# EAGLE design HSIO (EAGLE 6.4)
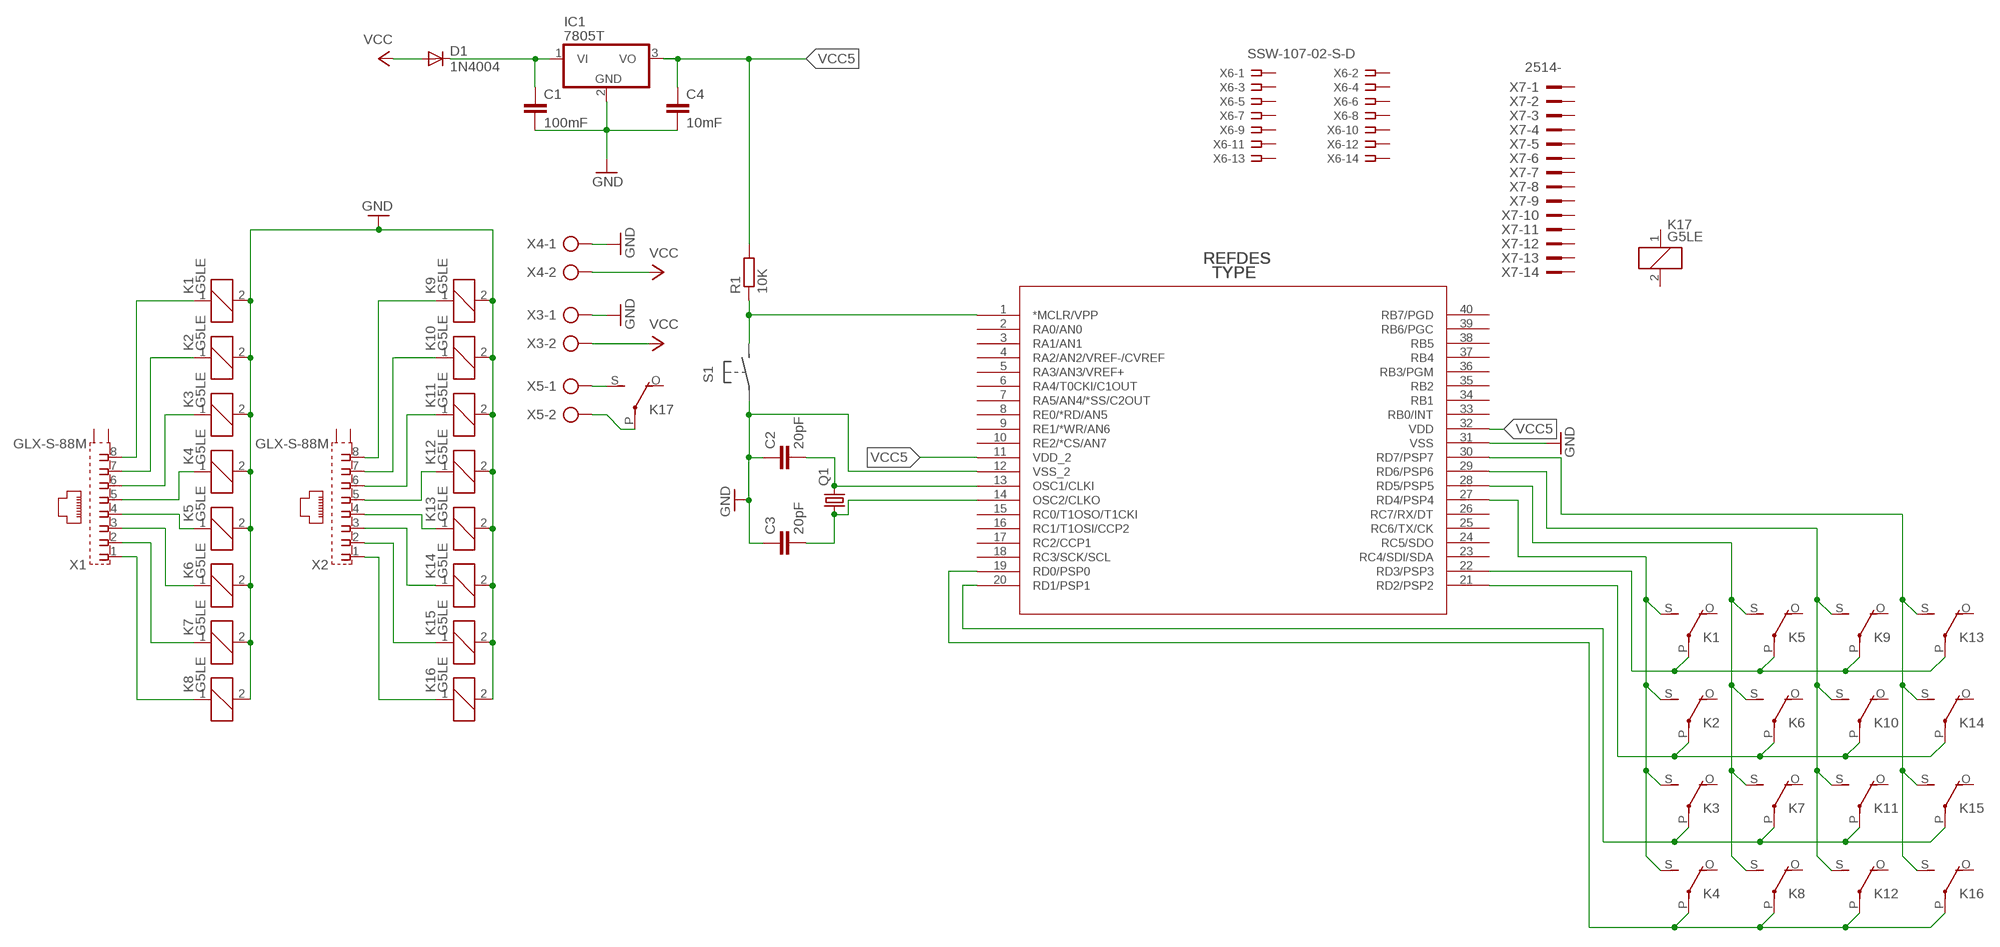
[diagram p0: schematic, sheet 1]

## Parts
C1  100mF  C10/4  [C10B4]
C2  20pF  C10/4  [C10B4]
C3  20pF  C10/4  [C10B4]
C4  10mF  C10/4  [C10B4]
D1  1N4004  [DO41-10]
IC1  7805T  [TO220H]
K1  G5LE  [G5LE]
K2  G5LE  [G5LE]
K3  G5LE  [G5LE]
K4  G5LE  [G5LE]
K5  G5LE  [G5LE]
K6  G5LE  [G5LE]
K7  G5LE  [G5LE]
K8  G5LE  [G5LE]
K9  G5LE  [G5LE]
K10  G5LE  [G5LE]
K11  G5LE  [G5LE]
K12  G5LE  [G5LE]
K13  G5LE  [G5LE]
K14  G5LE  [G5LE]
K15  G5LE  [G5LE]
K16  G5LE  [G5LE]
K17  G5LE  [G5LE]
Q1  CRYSTALHC49S  [HC49/S]
R1  10K  R-EU_0207/10  [0207/10]
U$1  PIC16F877A-X/P  [PDIP40_600MC]
X1  GLX-S-88M  [GLX-S-88M]
X2  GLX-S-88M  [GLX-S-88M]
X3  AK300/2  [AK300/2]
X4  AK300/2  [AK300/2]
X5  AK300/2  [AK300/2]
X6  SSW-107-02-S-D  [SSW-107-02-S-D]
X7  2514-  [PAK100/2500-14]

## Nets
GND: C1.2 C2.1 C3.1 C4.2 IC1.2(GND) K1.2 K2.2 K3.2 K4.2 K5.2 K6.2 K7.2 K8.2 K9.2 K10.2 K11.2 K12.2 K13.2 K14.2 K15.2 K16.2 U$1.12(VSS_2) U$1.31(VSS) X3.1 X4.1
N$1: K1.1 X1.8
N$2: K2.1 X1.7
N$3: K3.1 X1.6
N$4: K4.1 X1.5
N$5: K5.1 X1.4
N$6: K9.1 X2.8
N$7: K10.1 X2.7
N$8: K11.1 X2.6
N$9: K6.1 X1.3
N$10: K7.1 X1.2
N$11: K8.1 X1.1
N$12: K12.1 X2.5
N$13: K13.1 X2.4
N$14: K14.1 X2.3
N$15: K17.S(2:S) X5.1
N$16: K17.P(2:P) X5.2
N$17: K15.1 X2.2
N$18: K16.1 X2.1
N$19: K1.S(2:S) K2.S(2:S) K3.S(2:S) K4.S(2:S) U$1.27(RD4/PSP4)
N$20: K5.S(2:S) K6.S(2:S) K7.S(2:S) K8.S(2:S) U$1.28(RD5/PSP5)
N$21: K9.S(2:S) K10.S(2:S) K11.S(2:S) K12.S(2:S) U$1.29(RD6/PSP6)
N$22: K13.S(2:S) K14.S(2:S) K15.S(2:S) K16.S(2:S) U$1.30(RD7/PSP7)
N$23: K1.P(2:P) K5.P(2:P) K9.P(2:P) K13.P(2:P) U$1.22(RD3/PSP3)
N$24: K2.P(2:P) K6.P(2:P) K10.P(2:P) K14.P(2:P) U$1.21(RD2/PSP2)
N$25: K3.P(2:P) K7.P(2:P) K11.P(2:P) K15.P(2:P) U$1.20(RD1/PSP1)
N$26: K4.P(2:P) K8.P(2:P) K12.P(2:P) K16.P(2:P) U$1.19(RD0/PSP0)
N$28: C2.2 Q1.2 U$1.13(OSC1/CLKI)
N$29: R1.1 U$1.1(*MCLR/VPP)
N$30: C1.1 D1.C IC1.1(VI)
N$31: C3.2 Q1.1 U$1.14(OSC2/CLKO)
VCC: D1.A X3.2 X4.2
VCC5: C4.1 IC1.3(VO) R1.2 U$1.11(VDD_2) U$1.32(VDD)
Unconnected: K1.O(2:O) K2.O(2:O) K3.O(2:O) K4.O(2:O) K5.O(2:O) K6.O(2:O) K7.O(2:O) K8.O(2:O) K9.O(2:O) K10.O(2:O) K11.O(2:O) K12.O(2:O) K13.O(2:O) K14.O(2:O) K15.O(2:O) K16.O(2:O) K17.1 K17.2 K17.O(2:O) U$1.2(RA0/AN0) U$1.3(RA1/AN1) U$1.4(RA2/AN2/VREF-/CVREF) U$1.5(RA3/AN3/VREF+) U$1.6(RA4/T0CKI/C1OUT) U$1.7(RA5/AN4/*SS/C2OUT) U$1.8(RE0/*RD/AN5) U$1.9(RE1/*WR/AN6) U$1.10(RE2/*CS/AN7) U$1.15(RC0/T1OSO/T1CKI) U$1.16(RC1/T1OSI/CCP2) U$1.17(RC2/CCP1) U$1.18(RC3/SCK/SCL) U$1.23(RC4/SDI/SDA) U$1.24(RC5/SDO) U$1.25(RC6/TX/CK) U$1.26(RC7/RX/DT) U$1.33(RB0/INT) U$1.34(RB1) U$1.35(RB2) U$1.36(RB3/PGM) U$1.37(RB4) U$1.38(RB5) U$1.39(RB6/PGC) U$1.40(RB7/PGD) X1.S1 X1.S2 X2.S1 X2.S2 X6.1 X6.2 X6.3 X6.4 X6.5 X6.6 X6.7 X6.8 X6.9 X6.10 X6.11 X6.12 X6.13 X6.14 X7.1 X7.2 X7.3 X7.4 X7.5 X7.6 X7.7 X7.8 X7.9 X7.10 X7.11 X7.12 X7.13 X7.14

## Library data of the parts
C1-C4 = capacitor-wima:C: CAPACITOR naming: grid - package width
D1 = diode:1N4004: DIODE general purpose rectifier, 1 A
IC1 = linear:78*: Positive VOLTAGE REGULATOR Source: http://cache.national.com/ds/LM/LM78L05.pdf http://www.fairchildsemi.com/ds/LM/LM7805.pdf
K1-K17 = relay:G5LE: RELAY 1 x switch, 10 A/120 V AC, 8 A/30 V DC, Omron; OC_FARNELL: unknown; OC_NEWARK: unknown
Q1 = crystal:CRYSTAL: CRYSTAL; OC_FARNELL: 1667008; OC_NEWARK: unknown
R1 = resistor:R-EU_: RESISTOR, European symbol
U$1 = PIC16F877A:PIC16F877A-X/P
X1 X2 = con-kycon:GLX-S-88M: Mod. Jack, Right Angle, 8 posiotion, 8 contatcs RJ45 Source: GLX-S-88M.pdf; OC_FARNELL: unknown; OC_NEWARK: unknown
X3-X5 = con-ptr500:AK300/2: CONNECTOR; OC_FARNELL: unknown; OC_NEWARK: unknown
X6 = con-samtec:SSW-107-02-S-D: THROUGH-HOLE .025" SQ POST SOCKET Source: Samtec SSW.pdf; MPN: SSW-107-02-S-D; OC_FARNELL: unknown; OC_NEWARK: 11P9431
X7 = con-3m:2514-: 3M (TM) Pak 100 4-Wall Header Source: 3M; OC_FARNELL: unknown; OC_NEWARK: unknown

## Net classes
0 default: clearance 0.355 mm

## Board
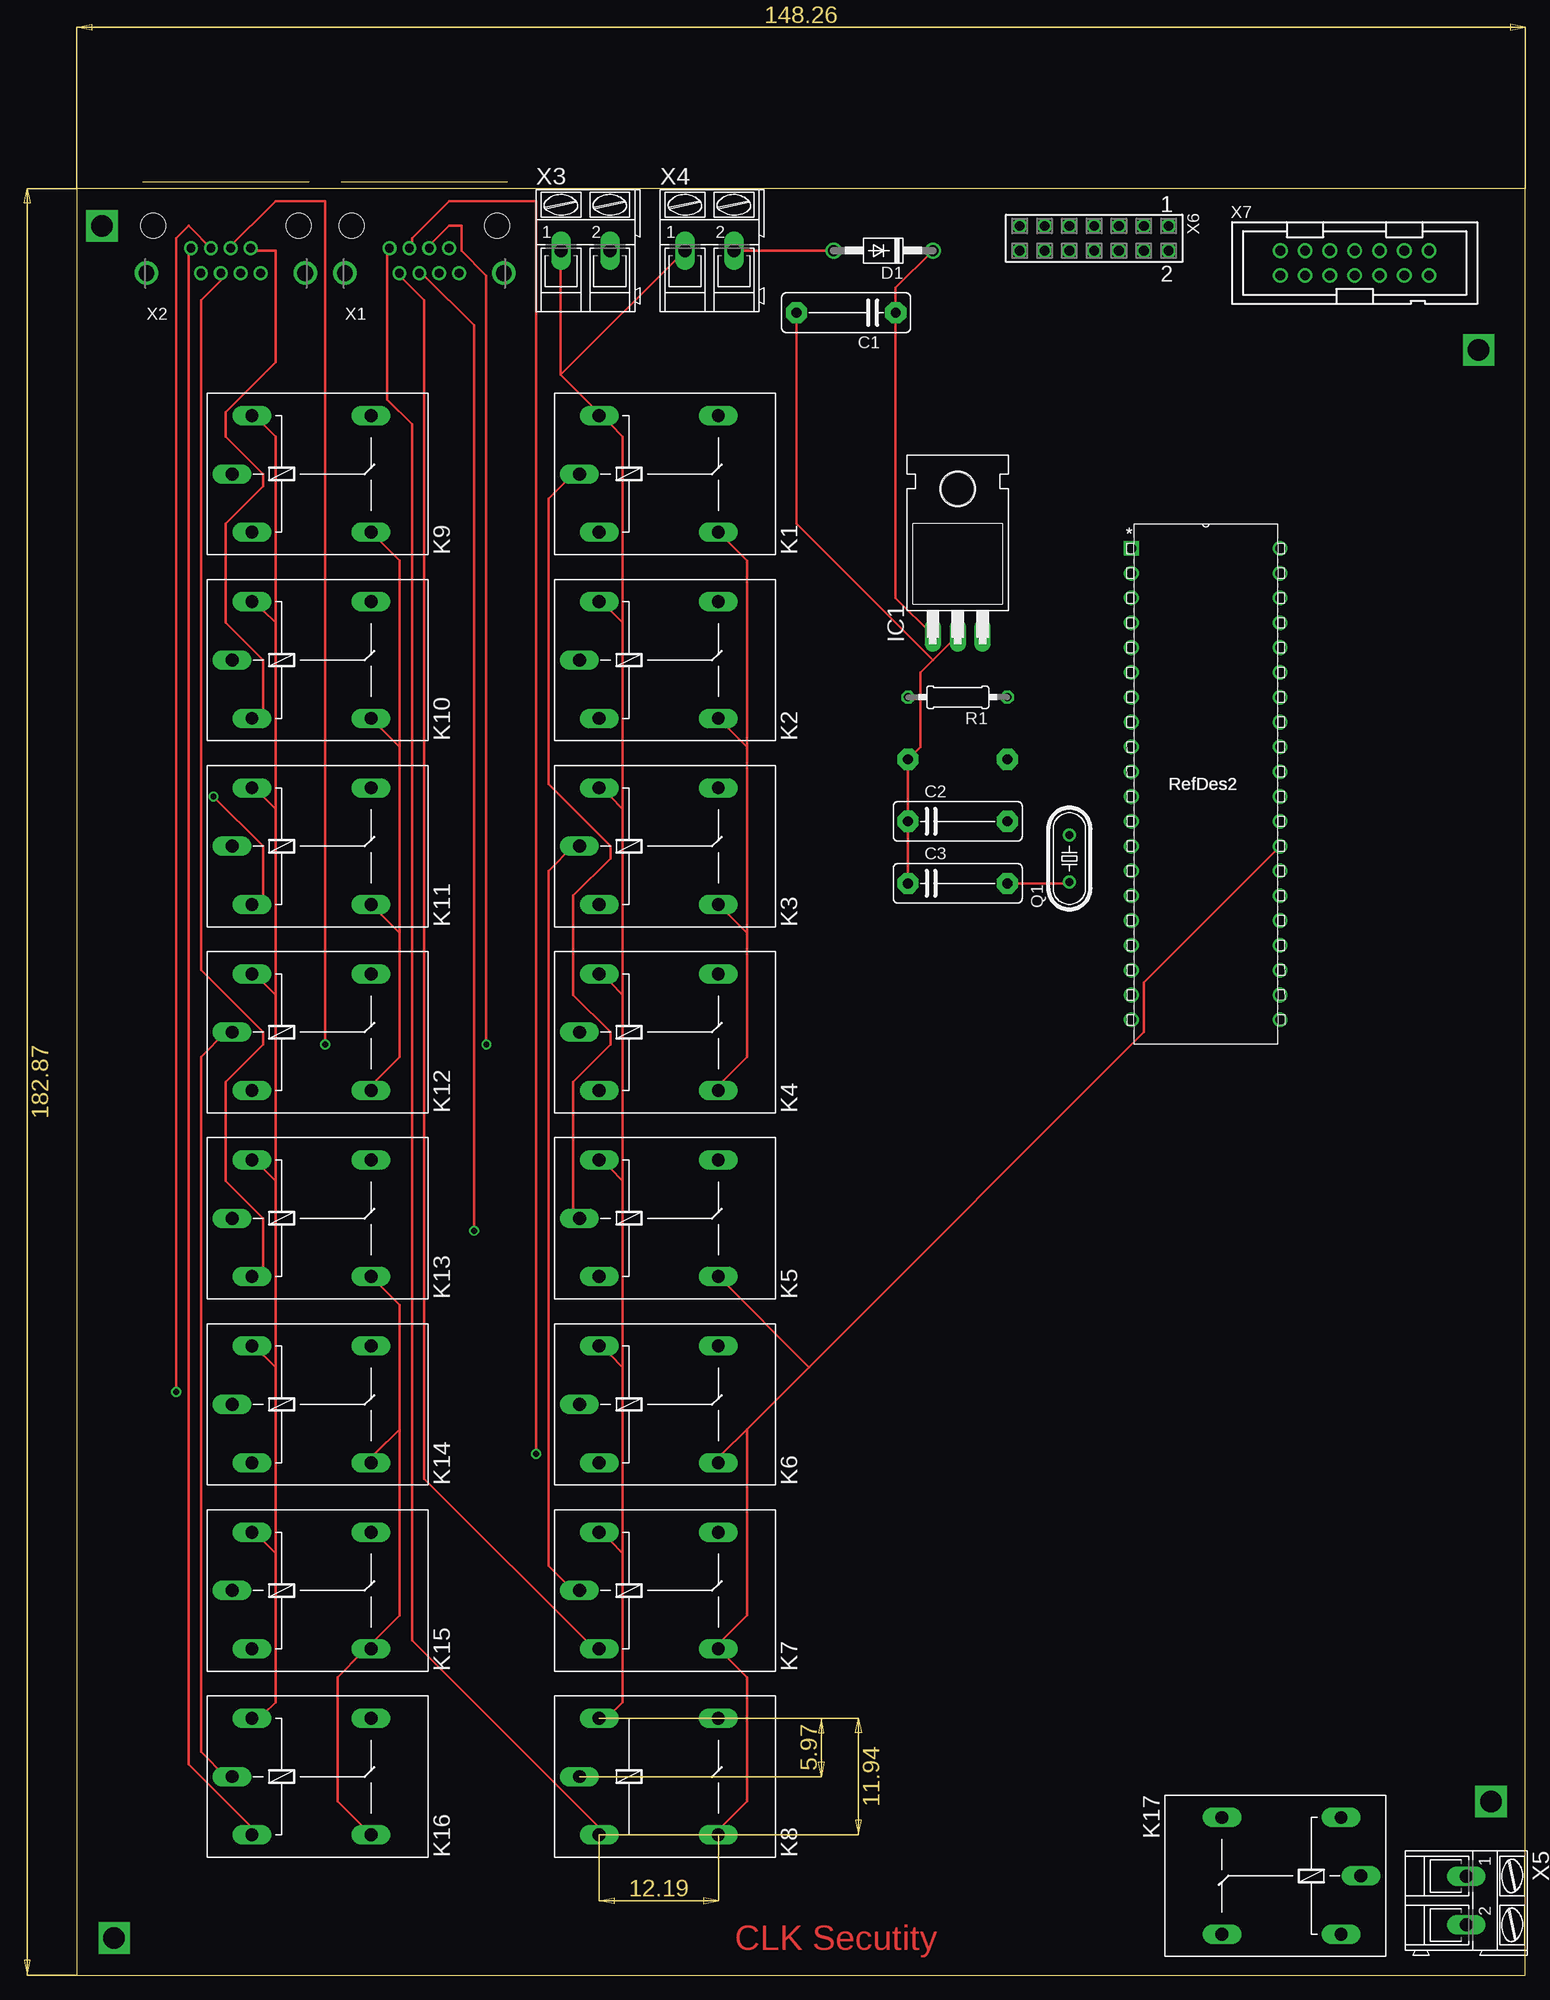
[diagram p1: board, top side]
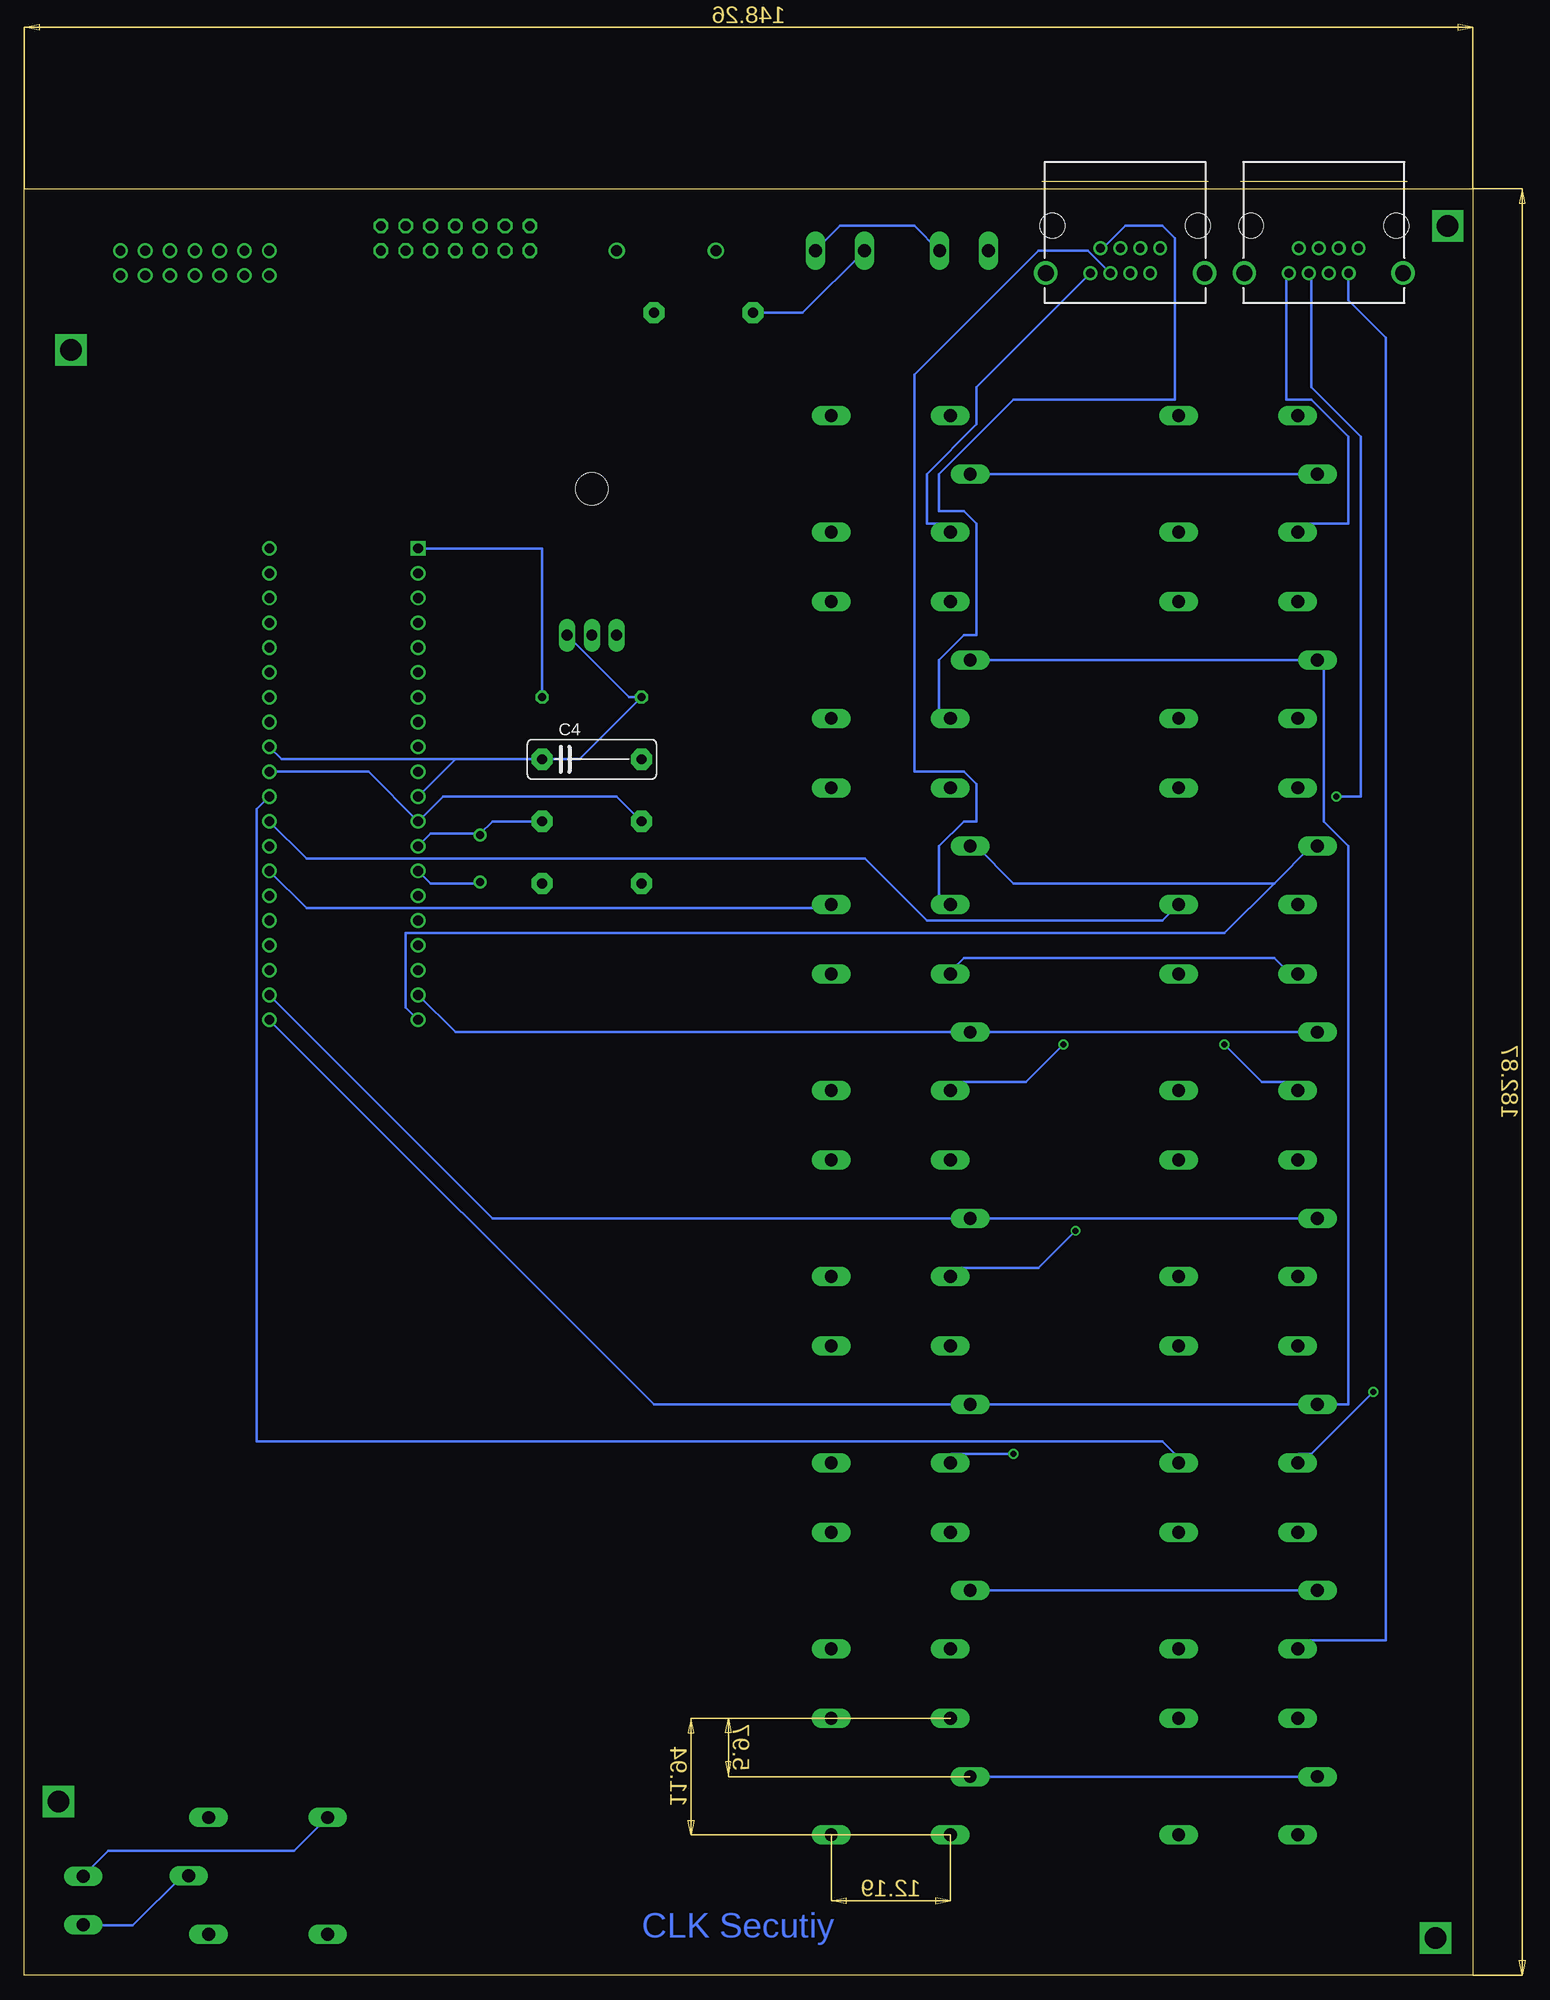
[diagram p2: board, bottom side, seen from below]

Size 148.26 x 182.87 mm. Coordinates in mm from the lower left corner, seen from the top.
Outline: 0,0 148.26,0 148.26,182.87 0,182.87 0,0
Copper layers (1*16): Top 0.035mm / dielectric 1.5mm / Bottom 0.035mm
Design rules "default": minimum track width 10mil, minimum drill 24mil, track to track 8mil, track to pad 8mil, pad to pad 8mil, via to via 8mil, smd to smd 8mil, copper to edge 40mil, drill to drill 8mil, minimum pad ring 10mil, minimum via ring 8mil, stop-mask expansion 4mil, vias tented up to drill 0mil, thermal gap 10mil

### Footprints (pad centres in the part's own frame; a part is rotated, then mirrored left to right if it is on the bottom)
C10B4 = drill 1.016 pad 2.159 octagon: 1 -5.08,0; 2 5.08,0
DO41-10 = drill 1.118: A 5.08,0; C -5.08,0
TO220H = drill 1.118 long: 1 -2.54,-10.16; 2 0,-10.16; 3 2.54,-10.16 | hole 3.302: 0,4.826
G5LE = drill 1.321 long: 1 -7.493,-5.969; 2 -7.493,5.969; O 4.699,5.969; P -9.525,0; S 4.699,-5.969
HC49/S = drill 0.813: 1 -2.413,0; 2 2.413,0
0207/10 = drill 0.813 octagon: 1 -5.08,0; 2 5.08,0
PDIP40_600MC = drill 0.991 square: 1 -15.24,48.26 | drill 0.991: 2 -15.24,45.72; 3 -15.24,43.18; 4 -15.24,40.64; 5 -15.24,38.1; 6 -15.24,35.56; 7 -15.24,33.02; 8 -15.24,30.48; 9 -15.24,27.94; 10 -15.24,25.4; 11 -15.24,22.86; 12 -15.24,20.32; 13 -15.24,17.78; 14 -15.24,15.24; 15 -15.24,12.7; 16 -15.24,10.16; 17 -15.24,7.62; 18 -15.24,5.08; 19 -15.24,2.54; 20 -15.24,0; 21 0,0; 22 0,2.54; 23 0,5.08; 24 0,7.62; 25 0,10.16; 26 0,12.7; 27 0,15.24; 28 0,17.78; 29 0,20.32; 30 0,22.86; 31 0,25.4; 32 0,27.94; 33 0,30.48; 34 0,33.02; 35 0,35.56; 36 0,38.1; 37 0,40.64; 38 0,43.18; 39 0,45.72; 40 0,48.26
GLX-S-88M = drill 0.9 pad 1.422: 1 -3.57,-2.3; 2 -2.55,-4.84; 3 -1.53,-2.3; 4 -0.51,-4.84; 5 0.51,-2.3; 6 1.53,-4.84; 7 2.55,-2.3; 8 3.57,-4.84 | drill 1.6 pad 2.184: S1 -8.125,-4.84; S2 8.125,-4.84 | hole 2.55: -7.44,0; 7.44,0
AK300/2 = drill 1.321 long: 1 -2.515,0; 2 2.489,0
SSW-107-02-S-D = drill 1 pad 1.5 octagon: 1 -7.62,-1.27; 2 -7.62,1.27; 3 -5.08,-1.27; 4 -5.08,1.27; 5 -2.54,-1.27; 6 -2.54,1.27; 7 0,-1.27; 8 0,1.27; 9 2.54,-1.27; 10 2.54,1.27; 11 5.08,-1.27; 12 5.08,1.27; 13 7.62,-1.27; 14 7.62,1.27
PAK100/2500-14 = drill 1 pad 1.422: 1 -7.62,-1.27; 2 -7.62,1.27; 3 -5.08,-1.27; 4 -5.08,1.27; 5 -2.54,-1.27; 6 -2.54,1.27; 7 0,-1.27; 8 0,1.27; 9 2.54,-1.27; 10 2.54,1.27; 11 5.08,-1.27; 12 5.08,1.27; 13 7.62,-1.27; 14 7.62,1.27

### Placement (x,y rotation side)
C1  78.74,170.18 180 top
C2  90.17,118.11 0 top
C3  90.17,111.76 0 top
C4  90.17,124.46 0 bottom
D1  82.55,176.53 180 top
IC1  90.17,147.32 0 top
K1  60.96,153.67 0 top
K2  60.96,134.62 0 top
K3  60.96,115.57 0 top
K4  60.96,96.52 0 top
K5  60.96,77.47 0 top
K6  60.96,58.42 0 top
K7  60.96,39.37 0 top
K8  60.96,20.32 0 top
K9  25.4,153.67 0 top
K10  25.4,134.62 0 top
K11  25.4,115.57 0 top
K12  25.4,96.52 0 top
K13  25.4,77.47 0 top
K14  25.4,58.42 0 top
K15  25.4,39.37 0 top
K16  25.4,20.32 0 top
K17  121.92,10.16 180 top
Q1  101.6,114.3 90 top
R1  90.17,130.81 180 top
U$1  123.19,97.79 0 top
X1  35.56,179.07 0 top
X2  15.24,179.07 0 top
X3  52.07,176.53 0 top
X4  64.77,176.53 0 top
X5  142.24,7.62 270 top
X6  104.14,177.8 180 top
X7  130.81,175.26 0 top

### Tracks (layer width: path | path; a pad name or v marks a point on that pad's centre or on a via)
GND
  Top 0.254: 20.32,43.18 20.32,27.94 19.05,26.67 K16.2 | 20.32,43.18 19.05,44.45 K15.2 | 20.32,62.23 19.05,63.5 K14.2 | 20.32,43.18 20.32,62.23 | 20.32,81.28 19.05,82.55 K13.2 | 20.32,62.23 20.32,81.28 | 20.32,100.33 19.05,101.6 K12.2 | 20.32,81.28 20.32,100.33 | 20.32,119.38 19.05,120.65 K11.2 | 20.32,100.33 20.32,119.38 | 20.32,138.43 19.05,139.7 K10.2 | 20.32,119.38 20.32,138.43 | 20.32,138.43 20.32,157.48 19.05,158.75 K9.2 | C3.1 C2.1 C4.2 86.36,125.73 86.36,133.35 87.63,134.62 | 87.63,134.62 IC1.2 | 49.53,163.83 53.34,160.02 K1.2 54.61,158.75 55.88,157.48 55.88,138.43 | 49.53,163.83 49.53,176.53 X3.1 | 49.53,163.83 62.23,176.53 X4.1 | 55.88,43.18 55.88,27.94 54.61,26.67 K8.2 | 55.88,43.18 54.61,44.45 K7.2 | 55.88,62.23 54.61,63.5 K6.2 | 55.88,43.18 55.88,62.23 | 55.88,81.28 54.61,82.55 K5.2 | 55.88,62.23 55.88,81.28 | 55.88,100.33 54.61,101.6 K4.2 | 55.88,81.28 55.88,100.33 | 55.88,119.38 54.61,120.65 K3.2 | 55.88,100.33 55.88,119.38 | 55.88,138.43 54.61,139.7 K2.2 | 55.88,119.38 55.88,138.43 | 87.63,134.62 73.66,148.59 C1.2
  Bottom 0.254: U$1.31 113.03,123.19 U$1.12 105.41,120.65 87.63,120.65 C2.1 | C1.2 68.58,170.18 62.23,176.53 X4.1 | K12.2 19.05,102.87 20.32,104.14 52.07,104.14 53.34,102.87 K4.2
N$1
  Bottom 0.254: X1.8 50.8,162.56 50.8,158.75 55.88,153.67 55.88,148.59 54.61,148.59 K1.1
N$2
  Bottom 0.254: X1.7 38.1,176.53 35.56,179.07 31.75,179.07 30.48,177.8 30.48,161.29 46.99,161.29 54.61,153.67 54.61,149.86 52.07,149.86 50.8,148.59 50.8,137.16 52.07,137.16 54.61,134.62 54.61,129.54 K2.1
N$3
  Bottom 0.254: X1.6 36.83,173.99 39.37,176.53 44.45,176.53 57.15,163.83 57.15,123.19 52.07,123.19 50.8,121.92 50.8,118.11 52.07,118.11 54.61,115.57 54.61,110.49 K3.1
N$4  (via drill 0.61)
  Top 0.254: v41.91,95.25 41.91,173.99 39.37,176.53 39.37,179.07 38.1,179.07 35.56,176.53 X1.5
  Bottom 0.254: v41.91,95.25 45.72,91.44 53.34,91.44 K4.1
N$5  (via drill 0.61)
  Top 0.254: v40.64,76.2 40.64,168.91 35.56,173.99 X1.4
  Bottom 0.254: v40.64,76.2 44.45,72.39 53.34,72.39 K5.1
N$6
  Bottom 0.254: X2.8 19.05,173.99 19.05,161.29 16.51,161.29 12.7,157.48 12.7,148.59 17.78,148.59 K9.1
N$7
  Top 0.254: X2.7 17.78,176.53 20.32,176.53 20.32,165.1 15.24,160.02 15.24,157.48 19.05,153.67 19.05,152.4 15.24,148.59 15.24,138.43 19.05,134.62 19.05,129.54 K10.1
N$8  (via drill 0.61)
  Top 0.254: v13.97,120.65 19.05,115.57 19.05,110.49 K11.1
  Bottom 0.254: v13.97,120.65 11.43,120.65 11.43,157.48 16.51,162.56 16.51,173.99 X2.6
N$9  (via drill 0.61)
  Top 0.254: v46.99,53.34 46.99,181.61 38.1,181.61 34.29,177.8 34.29,176.53 X1.3
  Bottom 0.254: v46.99,53.34 53.34,53.34 K6.1
N$10
  Top 0.254: X1.2 33.02,173.99 35.56,171.45 35.56,50.8 53.34,33.02 K7.1
N$11
  Top 0.254: X1.1 31.75,176.53 31.75,161.29 34.29,158.75 34.29,34.29 53.34,15.24 K8.1
N$12  (via drill 0.61)
  Top 0.254: v25.4,95.25 25.4,181.61 20.32,181.61 15.24,176.53 X2.5
  Bottom 0.254: v25.4,95.25 21.59,91.44 19.05,91.44 K12.1
N$13
  Top 0.254: X2.4 15.24,173.99 12.7,171.45 12.7,102.87 19.05,96.52 19.05,95.25 15.24,91.44 15.24,81.28 19.05,77.47 19.05,72.39 K13.1
N$14  (via drill 0.61)
  Top 0.254: v10.16,59.69 10.16,177.8 11.43,179.07 13.97,176.53 X2.3
  Bottom 0.254: v10.16,59.69 16.51,53.34 17.78,53.34 K14.1
N$15
  Bottom 0.254: K17.S 120.65,12.7 139.7,12.7 142.24,10.16 X5.1
N$16
  Bottom 0.254: K17.P 132.08,10.16 137.16,5.08 142.24,5.08 X5.2
N$17
  Bottom 0.254: X2.2 12.7,173.99 12.7,171.45 8.89,167.64 8.89,34.29 17.78,34.29 K15.1
N$18
  Top 0.254: X2.1 11.43,176.53 11.43,21.59 17.78,15.24 K16.1
N$19
  Top 0.254: 68.58,106.68 68.58,93.98 66.04,91.44 K4.S | K3.S 68.58,106.68 | 68.58,125.73 K2.S | 68.58,106.68 68.58,125.73 | K1.S 68.58,144.78 68.58,125.73
  Bottom 0.254: U$1.27 119.38,109.22 66.04,109.22 K3.S
N$20
  Top 0.254: K8.S 66.04,15.24 68.58,17.78 68.58,30.48 K7.S 66.04,34.29 68.58,36.83 68.58,55.88 | U$1.28 109.22,101.6 109.22,96.52 74.93,62.23 | 68.58,55.88 66.04,53.34 K6.S | 68.58,55.88 74.93,62.23 | 74.93,62.23 K5.S
N$21
  Top 0.254: 33.02,106.68 33.02,93.98 30.48,91.44 K12.S | K11.S 33.02,106.68 | 33.02,125.73 K10.S | 33.02,106.68 33.02,125.73 | K9.S 33.02,144.78 33.02,125.73
  Bottom 0.254: U$1.29 119.38,114.3 62.23,114.3 55.88,107.95 31.75,107.95 K11.S
N$22
  Top 0.254: K16.S 26.67,17.78 26.67,30.48 29.21,33.02 K15.S 30.48,34.29 33.02,36.83 33.02,55.88 | K13.S 33.02,68.58 33.02,55.88 | 33.02,55.88 30.48,53.34 K14.S
  Bottom 0.254: U$1.30 124.46,119.38 124.46,54.61 31.75,54.61 30.48,53.34 K14.S
N$23
  Top 0.254: K1.P 50.8,153.67 48.26,151.13 48.26,121.92 54.61,115.57 54.61,114.3 50.8,110.49 50.8,100.33 54.61,96.52 54.61,95.25 50.8,91.44 50.8,77.47 K5.P
  Bottom 0.254: K1.P K9.P | U$1.22 100.33,77.47 K5.P K13.P
N$24
  Bottom 0.254: K2.P K10.P 15.24,134.62 15.24,118.11 12.7,115.57 12.7,58.42 K14.P K6.P 83.82,58.42 U$1.21
N$25
  Top 0.254: K7.P 50.8,39.37 48.26,41.91 48.26,113.03 50.8,115.57 K3.P
  Bottom 0.254: K7.P K15.P | U$1.20 109.22,99.06 109.22,106.68 25.4,106.68 20.32,111.76 | 20.32,111.76 16.51,115.57 K11.P | 20.32,111.76 46.99,111.76 50.8,115.57 K3.P
N$26
  Top 0.254: K16.P 15.24,20.32 12.7,22.86 12.7,93.98 15.24,96.52 K12.P
  Bottom 0.254: K8.P K16.P | U$1.19 104.14,96.52 K4.P K12.P
N$27  (via drill 2.2)
  other vias: 2.54,179.07
N$28
  Bottom 0.254: 101.6,116.84 100.33,118.11 C2.2 | U$1.13 106.68,116.84 101.6,116.84 | 101.6,116.84 Q1.2
N$29
  Bottom 0.254: R1.1 95.25,146.05 U$1.1
N$30
  Top 0.254: IC1.1 83.82,140.97 C1.1 83.82,172.72 D1.C
N$31
  Top 0.254: C3.2 101.6,111.76 Q1.1
  Bottom 0.254: U$1.14 106.68,111.76 101.6,111.76 Q1.1
N$32  (via drill 2.2)
  other vias: 3.81,3.81
N$33  (via drill 2.2)
  other vias: 144.78,17.78
N$34  (via drill 2.2)
  other vias: 143.51,166.37
VCC
  Top 0.254: X4.2 D1.A
  Bottom 0.254: X3.2 54.61,176.53 57.15,179.07 64.77,179.07 67.31,176.53 X4.2
VCC5
  Bottom 0.254: 104.14,124.46 U$1.11 | 104.14,124.46 C4.1 91.44,124.46 R1.2 86.36,130.81 IC1.3 | U$1.32 121.92,124.46 104.14,124.46

### Text on the board
Top: CLK Secutity
Bottom: CLK Secutiy